# EAGLE design LCD backpack (EAGLE 6.5.0)
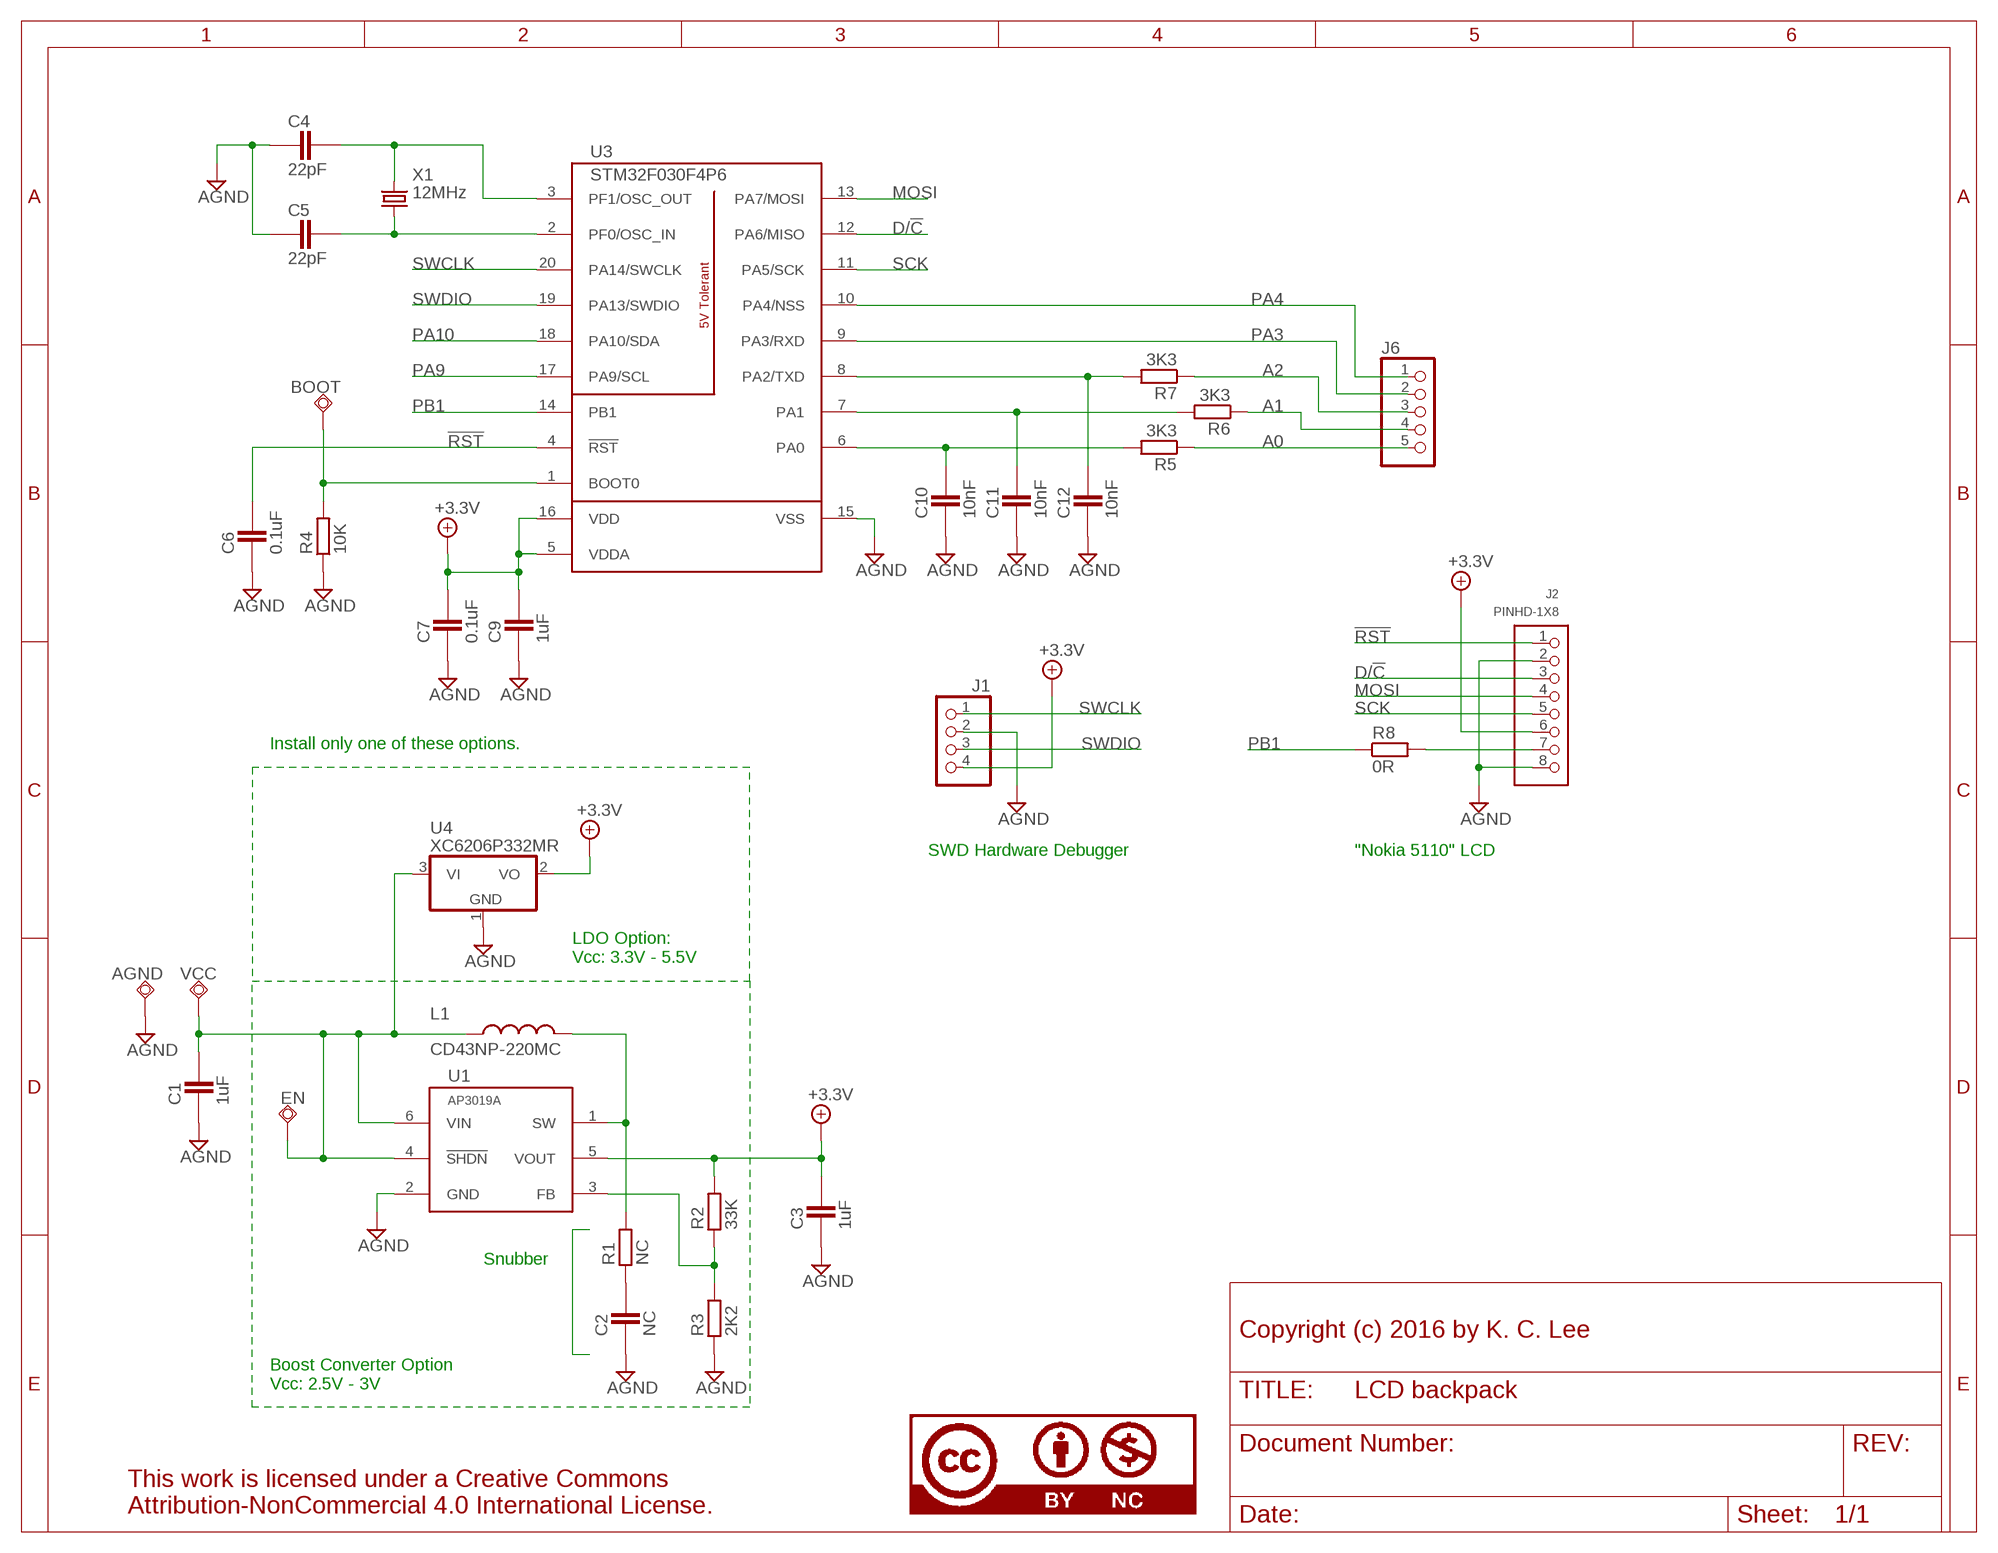
[diagram p0: schematic, sheet 1]

## Parts
AGND  TPSQTP10SQ  [TP10SQ]
BOOT  TPSQTP10SQ  [TP10SQ]
C1  1uF  CAPACITOR_0603  [CAPC1608X92N]
C2  NC  CAPACITOR_0603  [CAPC1608X92N]
C3  1uF  CAPACITOR_0603  [CAPC1608X92N]
C4  22pF  CAPACITOR_0603  [CAPC1608X92N]
C5  22pF  CAPACITOR_0603  [CAPC1608X92N]
C6  0.1uF  CAPACITOR_0603  [CAPC1608X92N]
C7  0.1uF  CAPACITOR_0603  [CAPC1608X92N]
C9  1uF  CAPACITOR_0603  [CAPC1608X92N]
C10  10nF  CAPACITOR_0603  [CAPC1608X92N]
C11  10nF  CAPACITOR_0603  [CAPC1608X92N]
C12  10nF  CAPACITOR_0603  [CAPC1608X92N]
EN  TPSQTP06SQ  [TP06SQ]
J1  PINHD-1X4_2.54  [1X04]
J2  PINHD-1X8  [1X08]
J6  PINHD-1X5_2.00  [1X05M]
L1  CD43NP-220MC  CD43  [CD43]
LICENSE1  CC-BY-NCNONE  [CC-NONE]
R1  NC  RESISTOR_0603  [RESC1608X55N]
R2  33K  RESISTOR_0603  [RESC1608X55N]
R3  2K2  RESISTOR_0603  [RESC1608X55N]
R4  10K  RESISTOR_0603  [RESC1608X55N]
R5  3K3  RESISTOR_0603  [RESC1608X55N]
R6  3K3  RESISTOR_0603  [RESC1608X55N]
R7  3K3  RESISTOR_0603  [RESC1608X55N]
R8  0R  RESISTOR_0603  [RESC1608X55N]
U1  AP3019A  AP3019  [SOT26]
U3  STM32F030F4P6  [TSSOP20]
U4  XC6206P332MR  MCP1700/TT  [SOT95P280X135-3N]
VCC  TPSQTP10SQ  [TP10SQ]
X1  12MHz  CRYSTALHC49U-V  [HC49U-V]

## Nets
!RST: C6.2 J2.1 U3.4(!RST)
+3.3V: C3.2 C7.2 C9.2 J1.4 J2.6 R2.2 U1.5(VOUT) U3.5(VDDA) U3.16(VDD) U4.2(VO)
A0: J6.5 R5.1
A1: J6.4 R6.1
A2: J6.3 R7.1
AGND: AGND.TP C1.1 C2.1 C3.1 C4.1 C5.1 C6.1 C7.1 C9.1 C10.1 C11.1 C12.1 J1.2 J2.2 J2.8 R3.1 R4.1 U1.2(GND) U3.15(VSS) U4.1(GND)
BUTTON: C12.2 R7.2 U3.8(PA2/TXD)
D/!C: J2.3 U3.12(PA6/MISO)
MOSI: J2.4 U3.13(PA7/MOSI)
N$1: C2.2 R1.1
N$2: J2.7 R8.2
N$20: L1.1 R1.2 U1.1(SW)
N$26: R2.1 R3.2 U1.3(FB)
N$32: BOOT.TP R4.2 U3.1(BOOT0)
N$36: C10.2 R5.2 U3.6(PA0)
N$37: C11.2 R6.2 U3.7(PA1)
N$41: C5.2 U3.2(PF0/OSC_IN) X1.1
N$42: C4.2 U3.3(PF1/OSC_OUT) X1.2
PA3: J6.2 U3.9(PA3/RXD)
PA4: J6.1 U3.10(PA4/NSS)
PA9: U3.17(PA9/SCL)
PA10: U3.18(PA10/SDA)
PB1: R8.1 U3.14(PB1)
SCK: J2.5 U3.11(PA5/SCK)
SWCLK: J1.1 U3.20(PA14/SWCLK)
SWDIO: J1.3 U3.19(PA13/SWDIO)
VCC: C1.2 EN.TP L1.2 U1.4(!SHDN) U1.6(VIN) U4.3(VI) VCC.TP

## Notes on the sheet
- Install only one of these options.
- SWD Hardware Debugger | "Nokia 5110" LCD
- LDO Option: 
  Vcc: 3.3V - 5.5V
- Snubber
- Copyright (c) 2016 by K. C. Lee
- Boost Converter Option
  Vcc: 2.5V - 3V

## Library data of the parts
AGND BOOT EN VCC = testpad:TPSQ: Test pad; PARTNO: TESTPAD
C1 C3 C9 = ipc-7351-capacitor:CAPACITOR_; PARTNO: STOCK: 1UF/10V 20% TDK
C2 C4-C7 C10-C12 = ipc-7351-capacitor:CAPACITOR_; PARTNO: *
J1 = Misc Conn:PINHD-1X4: PIN HEADER; PARTNO: 1x04 header 2.54mm
J2 = Misc Conn:PINHD-1X8; PARTNO: 1x08 header 2.54mm
J6 = Misc Conn:PINHD-1X5: PIN HEADER; PARTNO: 1X5 header 2MM
L1 = Misc Inductors:CD; PARTNO: DK: 587-1626-1-ND
LICENSE1 = Misc logo:CC-BY-NC; PARTNO: *
R1-R8 = ipc-7351-resistor:RESISTOR_; PARTNO: *
U1 = Misc Power:AP3019; PARTNO: AP3019AKTR-G1
U3 = Misc Processor:STM32F030F4P6; PARTNO: *
U4 = Misc Power:MCP1700; PARTNO: *
X1 = crystal:CRYSTAL: CRYSTAL; OC_FARNELL: 1666969; OC_NEWARK: unknown; PARTNO: *

## Board
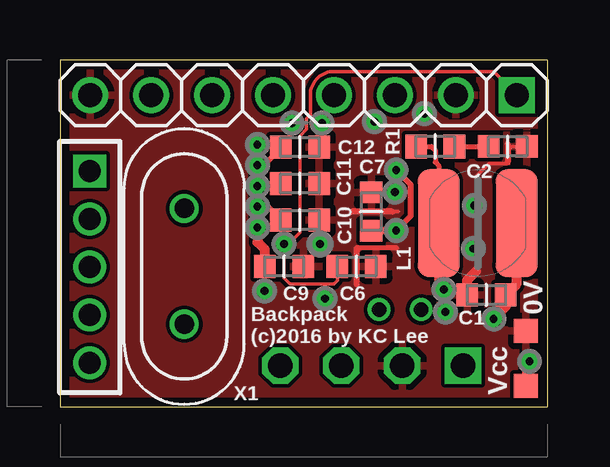
[diagram p1: board, top side]
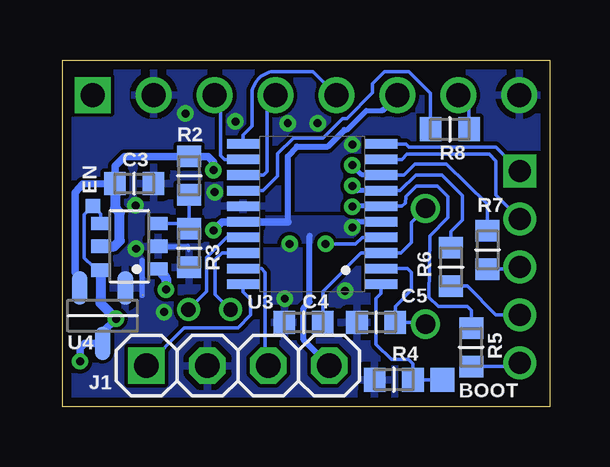
[diagram p2: board, bottom side, seen from below]

Size 20.32 x 14.48 mm. Coordinates in mm from the lower left corner, seen from the top.
Outline: 20.32,14.48 0,14.48 0,0 20.32,0 20.32,14.48
Copper layers (1*16): Top 0.0356mm / dielectric 1.5011mm / Bottom 0.0356mm
Design rules "oshpark-2layer-tented-vias": minimum track width 6mil, minimum drill 13mil, track to track 6mil, track to pad 6mil, pad to pad 6mil, via to via 6mil, smd to smd 6mil, copper to edge 15mil, drill to drill 6mil, minimum pad ring 7mil, minimum via ring 7mil, stop-mask expansion 4mil, vias tented up to drill 13mil, thermal gap 10mil
tRestrict: 6 lines
bRestrict: 5 lines

### Footprints (pad centres in the part's own frame; a part is rotated, then mirrored left to right if it is on the bottom)
TP10SQ = smd 1 x 1: TP 0,0
CAPC1608X92N = smd 0.9 x 0.95: 1 -0.8,0; 2 0.8,0
TP06SQ = smd 0.6 x 0.6: TP 0,0
1X04 = drill 1.016 square: 1 -3.81,0 | drill 1.016 octagon: 2 -1.27,0; 3 1.27,0; 4 3.81,0
1X08 = drill 1 square: 1 -8.89,0 | drill 1: 2 -6.35,0; 3 -3.81,0; 4 -1.27,0; 5 1.27,0; 6 3.81,0; 7 6.35,0; 8 8.89,0
1X05M = drill 0.914 square: 1 -4,0 | drill 0.914: 2 -2,0; 3 0,0; 4 2,0; 5 4,0
CD43 = smd 4.5 x 1.75: 1 0,1.625; 2 0,-1.625
RESC1608X55N = smd 0.9 x 1: 1 -0.8,0; 2 0.8,0
SOT26 = smd 0.55 x 0.8: 1 -0.95,-1.2; 2 0,-1.2; 3 0.95,-1.2; 4 0.95,1.2; 5 0,1.2; 6 -1,1.2
TSSOP20 = smd 0.4 x 1.35: 1 -2.925,-2.875; 2 -2.275,-2.875; 3 -1.625,-2.875; 4 -0.975,-2.875; 5 -0.325,-2.875; 6 0.325,-2.875; 7 0.975,-2.875; 8 1.625,-2.875; 9 2.275,-2.875; 10 2.925,-2.875; 11 2.925,2.875; 12 2.275,2.875; 13 1.625,2.875; 14 0.975,2.875; 15 0.325,2.875; 16 -0.325,2.875; 17 -0.975,2.875; 18 -1.625,2.875; 19 -2.275,2.875; 20 -2.925,2.875
SOT95P280X135-3N = smd 1.4 x 0.65: 1 -1.15,0.95; 2 -1.15,-0.95; 3 1.15,0
HC49U-V = drill 0.813: 1 -2.413,0; 2 2.413,0

### Placement (x,y rotation side)
AGND  19.43,3.17 0 top
BOOT  4.47,1.14 0 bottom
C1  17.78,4.67 0 top
C2  18.67,10.87 180 top
C3  17.32,9.32 180 bottom
C4  10.26,3.53 0 bottom
C5  7.24,3.53 0 bottom
C6  12.37,5.87 180 top
C7  12.98,8.15 270 top
C9  9.35,5.87 180 top
C10  10.01,7.8 180 top
C11  10.01,9.32 180 top
C12  10.01,10.85 180 top
EN  19.05,8.38 0 bottom
J1  13,1.73 0 bottom
J2  10.16,13 180 top
J6  1.24,5.84 270 top
L1  17.42,7.67 90 top
LICENSE1  0,0 0 top
R1  15.65,10.87 180 top
R2  15.04,9.65 90 bottom
R3  15.04,6.63 90 bottom
R4  6.5,1.14 0 bottom
R5  3.28,2.49 90 bottom
R6  4.11,5.84 90 bottom
R7  2.59,6.55 90 bottom
R8  4.17,11.58 0 bottom
U1  17.53,6.71 90 bottom
U3  9.91,8.05 90 bottom
U4  18.64,3.81 270 bottom
VCC  19.43,0.89 0 top
X1  5.18,5.87 90 top

### Tracks (layer width: path | path; a pad name or v marks a point on that pad's centre or on a via)
!RST  (via drill 0.33)
  Top 0.152: J2.1 18.09,14 11.43,14 arc90 10.44,13 10.44,12.19 10.29,12.04 10.29,11.58 10.01,11.3 10.01,7.29 9.53,6.81 v9.35,6.81 9.35,5.38 9.6,5.13 11.43,5.13 11.57,5.27 C6.2
  Bottom 0.152: U3.4 7.81,7.08 8.1,6.81 v9.35,6.81
+3.3V  (via drill 0.33)
  Top 0.254: v14.02,7.37 14.63,7.98 14.63,9.27 v14.02,9.88
  Top 0.305: v14.02,7.37 12.99,7.37 C7.2
  Top 0.406: v8.23,7.49 8.23,6.88 8.55,6.57 C9.2
  Bottom 0.203: U3.5 8,7.73 v8.23,7.49 | 8.56,11.56 8.46,11.56 7.64,12.37 6.99,12.37
  Bottom 0.254: J1.4 10.26,2.79 10.26,4.14 10.01,4.39 10.01,7.14 | 10.92,7.73 10.92,10.46 10.54,10.87 9.25,10.87 8.56,11.56 | 6.99,12.37 J2.6
  Bottom 0.305: 10.92,7.73 U3.16 13.66,7.73 v14.02,7.37 | U4.2 19.59,5.42 19.79,5.61 19.79,8.94 19.48,9.3 C3.2 18.11,9.33 18.11,10.06 17.72,10.45 R2.2 14.26,10.45 14.25,10.44 14.02,10.21 v14.02,9.88
  Bottom 0.406: U1.5 18.16,6.71 17.93,6.93 17.93,8.1 18.12,8.29 C3.2
  pour Bottom: 7.65,7.92 11.84,7.92 11.86,6.88 7.65,6.88
A0
  Bottom 0.152: R5.1 1.4,1.69 J6.5
A1
  Bottom 0.152: R6.1 3.44,5.04 2.24,3.84 J6.4
A2
  Bottom 0.152: J6.3 1.33,5.75 R7.1
AGND  (via drill 0.33)  (1 unrouted)
  Top 0.152: C2.1 18.87,10.87 18.67,10.67 18.67,10.21 18.64,10.16 17.88,10.16 17.4,9.68 | 14.11,8.15 13.87,8.15
  Top 0.203: 14.05,6.63 12.34,6.63
  Top 0.254: 13.87,8.15 12.17,8.15 | 12.37,6.6 12.37,5.13 | 18.67,10.97 18.67,10.21
  Top 0.406: C1.1 16.98,5.3 17.35,5.66
  Bottom 0.152: 15.09,6.71 15.06,6.53
  Bottom 0.203: U1.2 15.09,6.71
  Bottom 0.229: 16.99,6.12 16.99,4.65
  other vias: 13.97,8.97 10.85,6.81 8.23,10.95 10.92,11.84 9.68,11.84 13.11,11.91 17.25,6.6 17.27,8.41 8.53,4.85 11.05,4.52 16.08,3.96 15.19,12.24
  pour Bottom (rank 2): 20.29,0 20.4,14.71 0,14.76 -0.03,0
  pour Top (rank 2): -0.03,0 0.05,14.73 20.35,14.73 20.29,0
BUTTON  (via drill 0.33)
  Top 0.203: C12.2 8.91,10.49 8.51,10.08 v8.23,10.08
  Bottom 0.152: U3.8 6.07,9.68 5.61,10.13 4.32,10.13 2.59,8.46 R7.2
  Bottom 0.203: U3.8 7.82,9.68 v8.23,10.08
D/!C
  Bottom 0.152: U3.12 13.55,10.33 13.72,10.49 13.72,12.75 J2.3
MOSI
  Bottom 0.152: U3.13 11.94,9.68 11.79,9.83 11.79,12.65 J2.4
N$1
  Top 0.203: R1.1 C2.2
N$2
  Bottom 0.152: R8.2 3.37,12.56 J2.7
N$20  (via drill 0.33)
  Top 0.152: 15.8,7.75 L1.1
  Top 0.203: 15.8,7.75 15.8,10.06 15.65,10.21 15.65,10.72 15.49,10.87 R1.2
  Top 0.406: L1.1 15.8,5.11 v16,4.9
  Bottom 0.406: U1.1 16,5.35 v16,4.9
N$26
  Bottom 0.152: R2.1 R3.2 15.26,7.66 U1.3
N$32
  Bottom 0.152: U3.1 7.03,4.73 7.24,4.52 7.24,2.62 6.6,1.98 5.89,1.98 5.7,1.79 R4.2 BOOT.TP
N$36  (via drill 0.33)
  Top 0.203: v8.23,8.36 8.67,8.36 C10.2
  Bottom 0.152: U3.6 6.15,8.38 6.02,8.51 5.99,8.79 5.56,9.22 4.67,9.22 4.24,8.79 4.24,7.9 5,7.14 5.03,4.57 4.65,4.19 3.43,4.19 3.28,4.04 R5.2
  Bottom 0.203: U3.6 8.21,8.38 v8.23,8.36
N$37  (via drill 0.33)
  Top 0.203: v8.23,9.22 8.33,9.32 C11.2
  Bottom 0.152: U3.7 6.24,9.03 5.59,9.68 4.5,9.68 3.63,8.81 3.63,7.8 4.12,7.32 R6.2
  Bottom 0.203: U3.7 8.04,9.03 v8.23,9.22
  Bottom 0.254: 7.02,9.02 U3.7
N$41
  Bottom 0.152: X1.1 5.26,3.53 C5.2 6.44,4.2 5.77,4.88 5.77,5.61 5.93,5.78 U3.2
N$42
  Bottom 0.152: X1.2 5.77,7.7 5.77,6.86 6.2,6.43 U3.3 7.87,6.43 9.46,4.81 C4.2
PA3
  Bottom 0.152: U3.9 6.16,10.33 5.94,10.54 2.52,10.54 2.23,10.26 2.23,8.83 J6.2
PA4
  Bottom 0.152: U3.10 6,10.98 5.87,10.85 2.25,10.85 J6.1
PA9  (via drill 0.6)
  Bottom 0.152: U3.17 13.47,7.08 14.3,6.25 14.3,4.83 v15.06,4.06
PA10  (via drill 0.6)
  Bottom 0.152: U3.18 13.66,6.43 13.95,6.15 13.95,4.7 v13.31,4.06
PB1
  Bottom 0.152: U3.14 11.95,9.03 11.35,9.63 11.35,10.57 10.69,11.23 9.45,11.23 8.64,12.04 8.46,12.04 7.39,13.11 7.39,13.49 6.88,14 5.87,14 4.97,13.09 R8.1
SCK
  Bottom 0.152: U3.11 12.78,11.35 12.42,11.71 12.42,13 arc90 11.43,14 9.88,14 J2.5
SWCLK
  Bottom 0.152: U3.20 12.78,4.8 12.47,4.5 12.47,3.83 13.01,3.3 15.24,3.3 J1.1
SWDIO
  Bottom 0.152: U3.19 12.03,5.78 11.86,5.61 11.86,1.85 J1.3
VCC  (via drill 0.33)
  Top 0.305: VCC.TP 19.43,1.75 v19.58,1.91
  Top 0.406: L1.2 19.05,5.14 C1.2 18.58,4.18 v18.09,3.68
  Bottom 0.152: U1.6 19.04,5.86 19.41,6.22 19.41,8.03 EN.TP 18.73,8.06 U1.4
  Bottom 0.305: v18.09,3.68 18.64,3.12 U4.3 19.39,2.66 19.58,2.46 v19.58,1.91
  Bottom 0.406: U1.6 18.73,4.32 v18.09,3.68

### Text on the board
tPlace: 0V | Backpack / (c)2016 by KC Lee | Vcc
tNames: L1